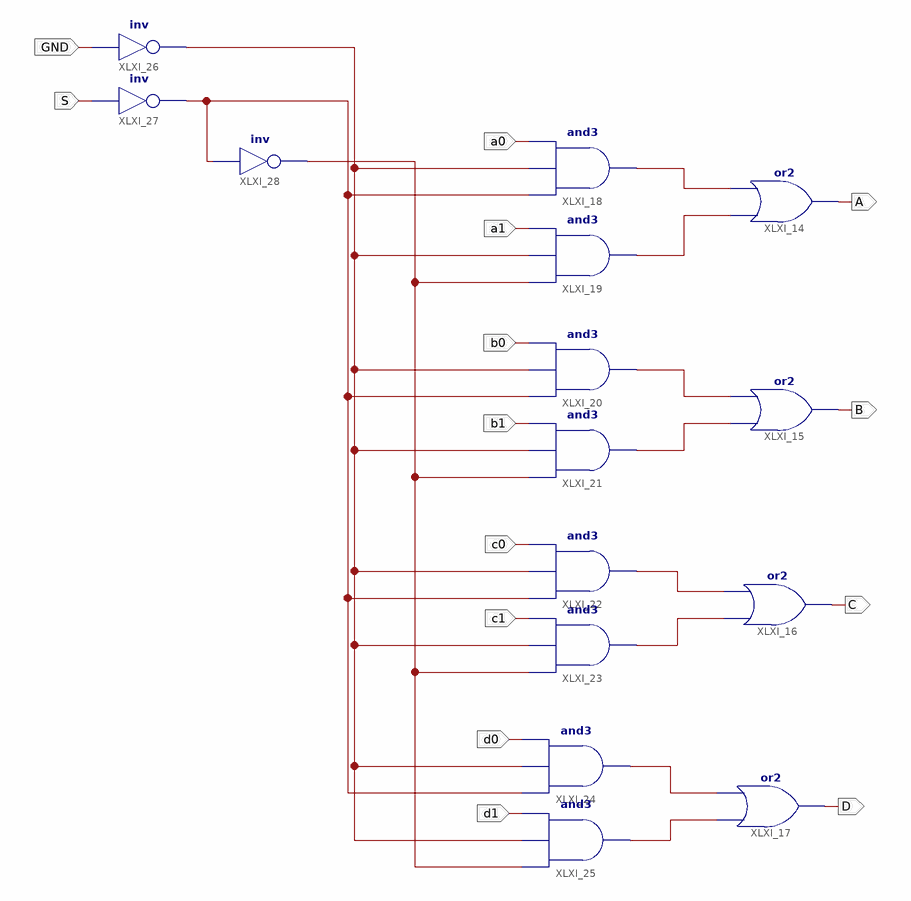
[diagram p0: schematic sheet 1]
// Xilinx ISE schematic mux8to4.sch (spartan6) as structural Verilog: 15 symbols, 14 ports
module mux8to4 (
  input  GND,
  input  S,
  input  a0,
  input  a1,
  input  b0,
  input  b1,
  input  c0,
  input  c1,
  input  d0,
  input  d1,
  output D,
  output C,
  output A,
  output B
);

  wire XLXN_2, XLXN_3, XLXN_4, XLXN_5, XLXN_6, XLXN_7, XLXN_8, XLXN_9, XLXN_15, XLXN_28, XLXN_29;

  or XLXI_14 (A, XLXN_3, XLXN_2);
  or XLXI_15 (B, XLXN_5, XLXN_4);
  or XLXI_16 (C, XLXN_7, XLXN_6);
  or XLXI_17 (D, XLXN_9, XLXN_8);
  and XLXI_18 (XLXN_2, XLXN_28, XLXN_15, a0);
  and XLXI_19 (XLXN_3, XLXN_29, XLXN_15, a1);
  and XLXI_20 (XLXN_4, XLXN_28, XLXN_15, b0);
  and XLXI_21 (XLXN_5, XLXN_29, XLXN_15, b1);
  and XLXI_22 (XLXN_6, XLXN_28, XLXN_15, c0);
  and XLXI_23 (XLXN_7, XLXN_29, XLXN_15, c1);
  and XLXI_24 (XLXN_8, XLXN_28, XLXN_15, d0);
  and XLXI_25 (XLXN_9, XLXN_29, XLXN_15, d1);
  not XLXI_26 (XLXN_15, GND);
  not XLXI_27 (XLXN_28, S);
  not XLXI_28 (XLXN_29, XLXN_28);
endmodule
